# Altium schematic sheet LowerMachine_test_v3.0.SchDoc
size A4
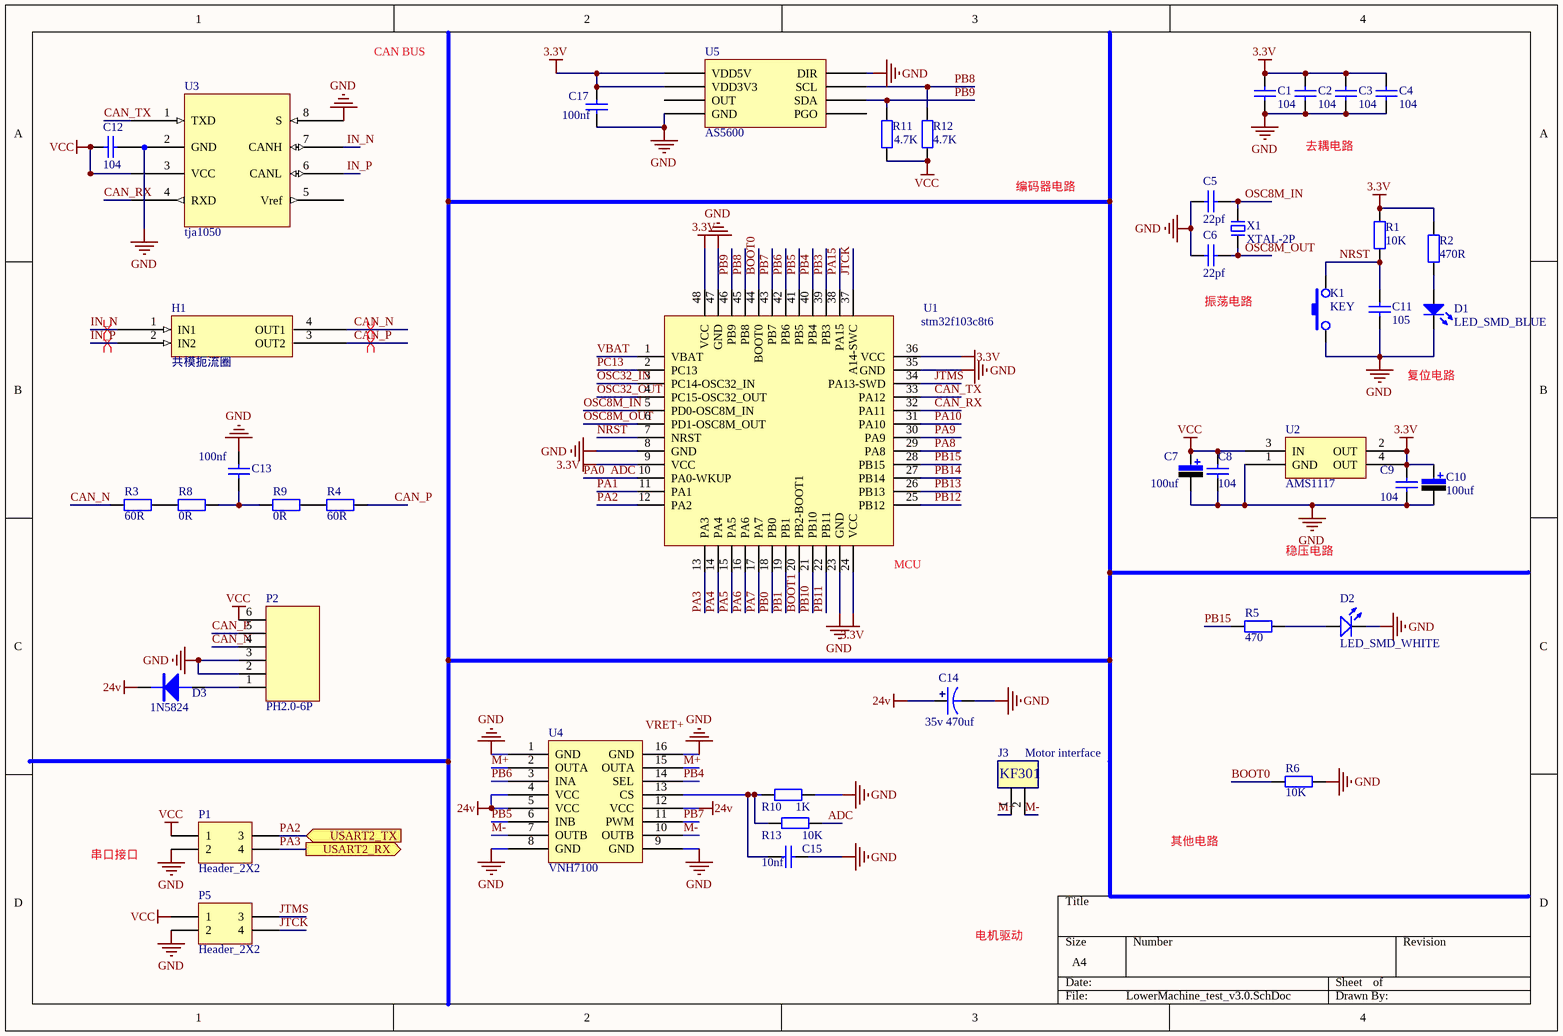
[diagram p0: LowerMachine_test_v3.0.SchDoc]

## Parts
C1  104  [Cap-0603]
C2  104  [Cap-0603]
C3  104  [Cap-0603]
C4  104  [Cap-0603]
C5  22pf  [Cap-0603]
C6  22pf  [Cap-0603]
C7  100uf  [tan_cap_C]
C8  104  [Cap-0603-M]
C9  104  [Cap-0603-M]
C10  100uf  [tan_cap_C]
C11  105  [Cap-0603]
C12  104  [Cap-0603]
C13  100nf  [Cap-0603]
C14  35v 470uf  [CAPE_G_10X10.3X10.2]
C15  10nf  [Cap-0603]
C17  100nf  [Cap-0603]
D1  LED_SMD_BLUE  [LED_0603_B]
D2  LED_SMD_WHITE  [LED_0603_W]
D3  1N5824  [DO-214AC/SMA]
H1  共模扼流圈  [共模扼流圈]
J3  Motor interface  [KF301-5.0-2P]
K1  KEY  [SW-SMD-2X4]
P1  Header_2X2  [Header_SMD_2.54X2]
P2  PH2.0-6P  [PH2.0S-6P]
P5  Header_2X2  [Header_SMD_2.54X2]
R1  10K  [Res-0603]
R2  470R  [Res-0603]
R3  60R  [Res-0603]
R4  60R  [Res-0603]
R5  470  [Res-0603]
R6  10K  [Res-0603]
R8  0R  [Res-0603]
R9  0R  [Res-0603]
R10  1K  [Res-0603]
R11  4.7K  [Res-0603]
R12  4.7K  [Res-0603]
R13  10K  [Res-0603]
U1  stm32f103c8t6  [stm32f103c8t6]
U2  AMS1117  [AMS1117]
U3  tja1050  [tja1050]
U4  VNH7100  [VNH7100]
U5  AS5600  [AS5600]
X1  XTAL-2P  [OSC 5032-2P]

## Ports
USART2_RX (out), USART2_TX (in)

## Nets
3.3V: C1.2 C2.2 C3.2 C4.2 C9.2 C10.1 C17.2 R1.1 R2.1 U1.9(VCC) U1.24(VCC) U1.36(VCC) U1.48(VCC) U2.2(OUT) U2.4(OUT) U5.1(VDD5V) U5.2(VDD3V3)
24v: C14.1 D3.K U4.4(VCC) U4.5(VCC) U4.12(VCC)
GND: C1.1 C2.1 C3.1 C4.1 C5.2 C6.2 C7.2 C8.1 C9.1 C10.2 C11.1 C13.2 C14.2 C15.2 C17.1 D1.1(K) D2.1(K) K1.1 P1.2 P2.2 P2.3 P5.2 R6.1 R10.1 U1.8(GND) U1.23(GND) U1.35(GND) U1.47(GND) U2.1(GND) U3.8(S) U4.1(GND) U4.8(GND) U4.9(GND) U4.16(GND) U5.4(GND) U5.8(DIR)
VCC: C7.1 C8.2 C12.1 P1.1 P2.6 P5.1 R11.1 R12.1 U2.3(IN) U3.3(VCC)
ADC: R13.1 U1.10(PA0-WKUP)  [also labelled PA0]
BOOT0: R6.2 U1.44(BOOT0)
BOOT1: U1.20(PB2-BOOT1)
CAN_N: H1.4(OUT1) P2.4 R3.1
CAN_P: H1.3(OUT2) P2.5 R4.2
CAN_RX: U1.32(PA11) U3.4(RXD)
CAN_TX: U1.33(PA12) U3.1(TXD)
IN_N: H1.1(IN1) U3.7(CANH)
IN_P: H1.2(IN2) U3.6(CANL)
JTCK: P5.4 U1.37(A14-SWC)
JTMS: P5.3 U1.34(PA13-SWD)
M+: J3.1 U4.2(OUTA) U4.15(OUTA)
M-: J3.2 U4.7(OUTB) U4.10(OUTB)
NRST: C11.2 K1.3 R1.2 U1.7(NRST)
OSC8M_IN: C5.1 U1.5(PD0-OSC8M_IN) X1.2
OSC8M_OUT: C6.1 U1.6(PD1-OSC8M_OUT) X1.1
OSC32_IN: U1.3(PC14-OSC32_IN)
OSC32_OUT: U1.4(PC15-OSC32_OUT)
PA1: U1.11(PA1)
PA2: P1.3 U1.12(PA2) ; port USART2_TX
PA3: P1.4 U1.13(PA3) ; port USART2_RX
PA4: U1.14(PA4)
PA5: U1.15(PA5)
PA6: U1.16(PA6)
PA7: U1.17(PA7)
PA8: U1.29(PA8)
PA9: U1.30(PA9)
PA10: U1.31(PA10)
PA15: U1.38(PA15)
PB0: U1.18(PB0)
PB1: U1.19(PB1)
PB3: U1.39(PB3)
PB4: U1.40(PB4) U4.14(SEL)
PB5: U1.41(PB5) U4.6(INB)
PB6: U1.42(PB6) U4.3(INA)
PB7: U1.43(PB7) U4.11(PWM)
PB8: R12.2 U1.45(PB8) U5.7(SCL)
PB9: R11.2 U1.46(PB9) U5.6(SDA)
PB10: U1.21(PB10)
PB11: U1.22(PB11)
PB12: U1.25(PB12)
PB13: U1.26(PB13)
PB14: U1.27(PB14)
PB15: R5.1 U1.28(PB15)
PC13: U1.2(PC13)
VBAT: U1.1(VBAT)
NetC12_2: C12.2 U3.2(GND)
NetC13_1: C13.1 R8.2 R9.1
NetC15_1: C15.1 R10.2 R13.2 U4.13(CS)
NetD1_2: D1.2(A) R2.2
NetD2_2: D2.2(A) R5.2
NetD3_A: D3.A P2.1
NetR3_2: R3.2 R8.1
NetR4_1: R4.1 R9.2

Not connected (* = marked no-connect by the designer): U3 5(Vref); U5 3(OUT) 5(PGO)

## Layout directives
differential pair: CAN_N, CAN_P, IN_N, IN_P

## Notes on the sheet
- CAN BUS
- 去耦电路
- 编码器电路
- 振荡电路
- 复位电路
- (near U1) MCU
- 稳压电路
- 其他电路
- 串口接口
- 电机驱动
- Labels drawn without touching a wire or pin: VRET+
- (in symbol KF301-2P) KF301

## Library data of the parts
C1-C6 C8 C9 C11-C13 = CAP
C7 C10 = tan_cap
C14 = CAPE-SMD: 贴片电解电容
C15 C17 = CAP: 贴片陶瓷电容
D1 = LED_SMD_BLUE: 发光二极管; ComponentLink1Description: 供应商链接; ComponentLink1URL: http://www.szlcsc.com/product/details_73150.html; Package: 0603; Supplier: LC; SuppliersPartNumber: C72041
D2 = LED_SMD_WHITE: 发光二极管; ComponentLink1Description: 供应商链接; ComponentLink1URL: http://www.szlcsc.com/product/details_2663.html; Package: 0603; Supplier: LC; SuppliersPartNumber: C2290
D3 = DIODE: 普通二极管
J3 = KF301-2P
R1-R6 R8-R13 = RES: 贴片电阻
X1 = XTAL-2P: 2脚无源脚晶振